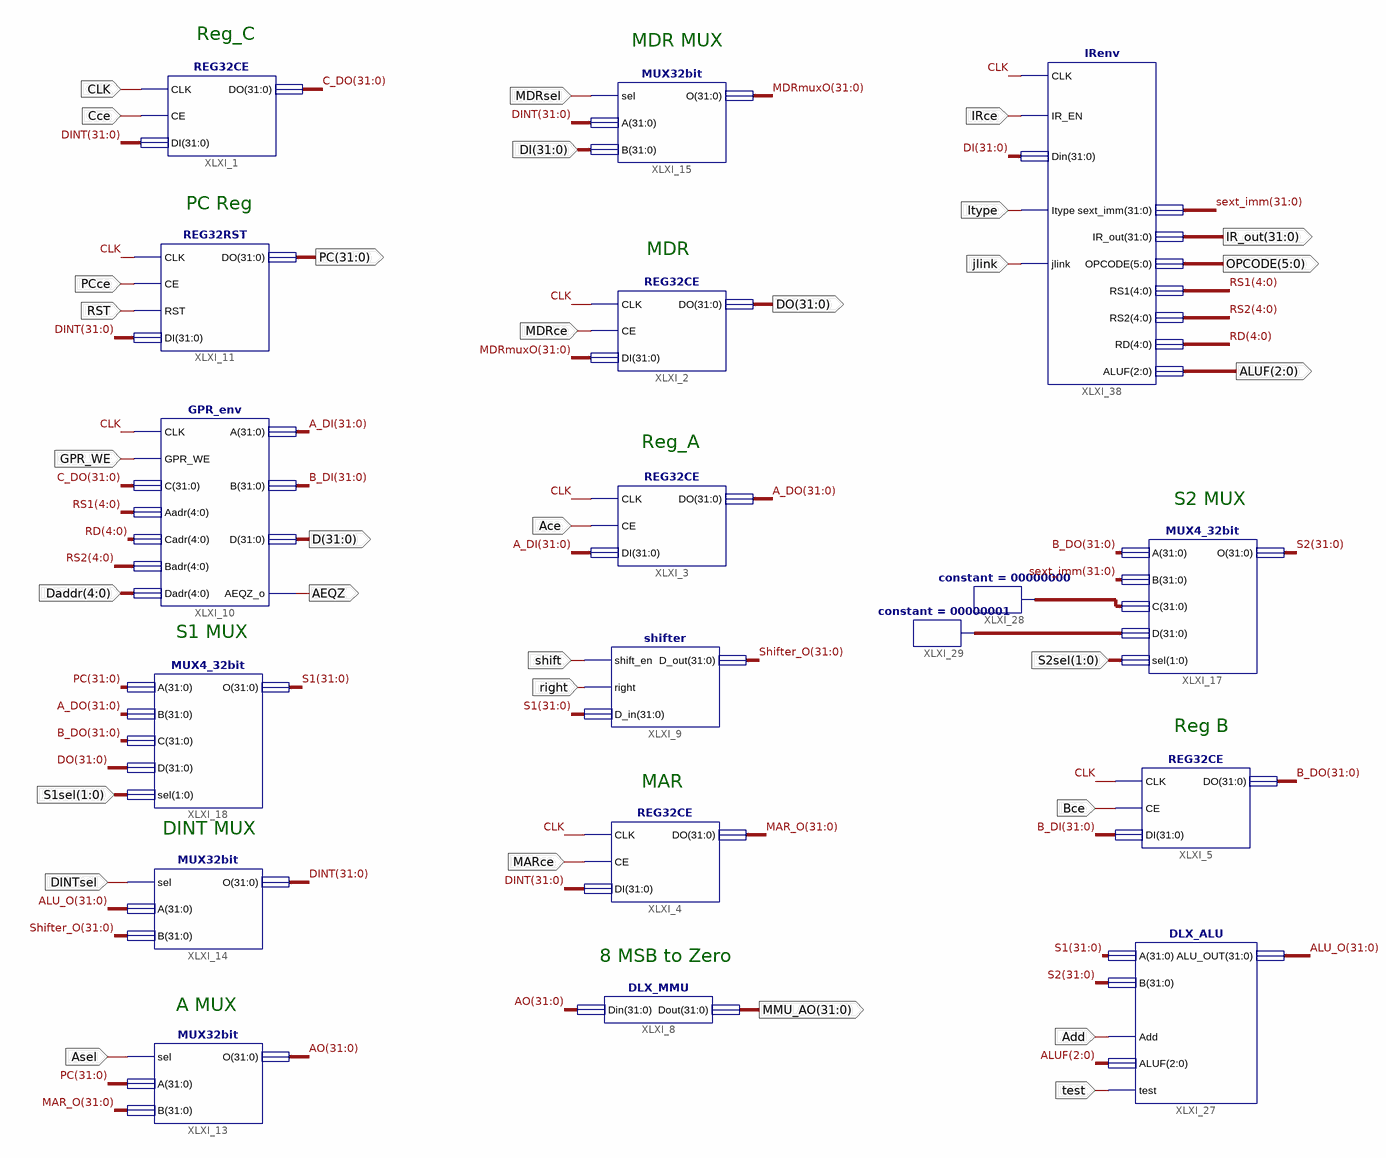
[diagram p0: schematic sheet 1]
// Xilinx ISE schematic DLX_DataPath.sch (spartan6) as structural Verilog: 18 symbols, 31 ports
module DLX_DataPath (
  input  MDRce,
  input  Ace,
  input  MARce,
  input  shift,
  input  right,
  input  Cce,
  input  CLK,
  input  Asel,
  input  DINTsel,
  input  MDRsel,
  input  [31:0] DI,
  input  [1:0] S1sel,
  input  GPR_WE,
  input  [4:0] Daddr,
  input  IRce,
  input  Itype,
  input  [1:0] S2sel,
  input  Add,
  input  test,
  input  Bce,
  input  jlink,
  input  PCce,
  input  RST,
  output [31:0] MMU_AO,
  output [31:0] DO,
  output [31:0] D,
  output AEQZ,
  output [31:0] PC,
  output [2:0] ALUF,
  output [31:0] IR_out,
  output [5:0] OPCODE
);

  wire [4:0] RD, RS1, RS2;
  wire [31:0] A_DI, A_DO, ALU_O, AO, B_DI, B_DO, C_DO, DINT, MAR_O, MDRmuxO, S1, S2, sext_imm, Shifter_O,
       XLXN_55, XLXN_56;

  REG32CE XLXI_2 (.CLK(CLK), .CE(MDRce), .DI(MDRmuxO), .DO(DO));
  REG32CE XLXI_3 (.CLK(CLK), .CE(Ace), .DI(A_DI), .DO(A_DO));
  REG32CE XLXI_4 (.CLK(CLK), .CE(MARce), .DI(DINT), .DO(MAR_O));
  DLX_MMU XLXI_8 (.Din(AO), .Dout(MMU_AO));
  shifter XLXI_9 (.shift_en(shift), .right(right), .D_in(S1), .D_out(Shifter_O));
  GPR_env XLXI_10 (
    .CLK(CLK), .GPR_WE(GPR_WE), .C(C_DO), .Aadr(RS1), .Cadr(RD), .Badr(RS2), .Dadr(Daddr), .A(A_DI),
    .B(B_DI), .D(D), .AEQZ_o(AEQZ));
  REG32CE XLXI_1 (.CLK(CLK), .CE(Cce), .DI(DINT), .DO(C_DO));
  MUX32bit XLXI_13 (.sel(Asel), .A(PC), .B(MAR_O), .O(AO));
  MUX32bit XLXI_14 (.sel(DINTsel), .A(ALU_O), .B(Shifter_O), .O(DINT));
  MUX32bit XLXI_15 (.sel(MDRsel), .A(DINT), .B(DI), .O(MDRmuxO));
  MUX4_32bit XLXI_18 (.A(PC), .B(A_DO), .C(B_DO), .D(DO), .sel(S1sel), .O(S1));
  MUX4_32bit XLXI_17 (.A(B_DO), .B(sext_imm), .C(XLXN_55), .D(XLXN_56), .sel(S2sel), .O(S2));
  constant #(.CValue("00000000")) XLXI_28 (.O(XLXN_55));
  constant #(.CValue("00000001")) XLXI_29 (.O(XLXN_56));
  DLX_ALU XLXI_27 (.A(S1), .B(S2), .Add(Add), .ALUF(ALUF), .ALU_OUT(ALU_O), .test(test));
  REG32CE XLXI_5 (.CLK(CLK), .CE(Bce), .DI(B_DI), .DO(B_DO));
  IRenv XLXI_38 (
    .CLK(CLK), .IR_EN(IRce), .Itype(Itype), .jlink(jlink), .Din(DI), .OPCODE(OPCODE), .RS1(RS1), .RS2(RS2),
    .RD(RD), .sext_imm(sext_imm), .ALUF(ALUF), .IR_out(IR_out));
  REG32RST XLXI_11 (.CLK(CLK), .CE(PCce), .RST(RST), .DI(DINT), .DO(PC));

  // Notes on the sheet:
  //   Reg_C
  //   MDR MUX
  //   PC Reg
  //   MDR
  //   Reg_A
  //   S2 MUX
  //   S1 MUX
  //   Reg B
  //   MAR
  //   DINT MUX
  //   8 MSB to Zero
  //   A MUX
endmodule
